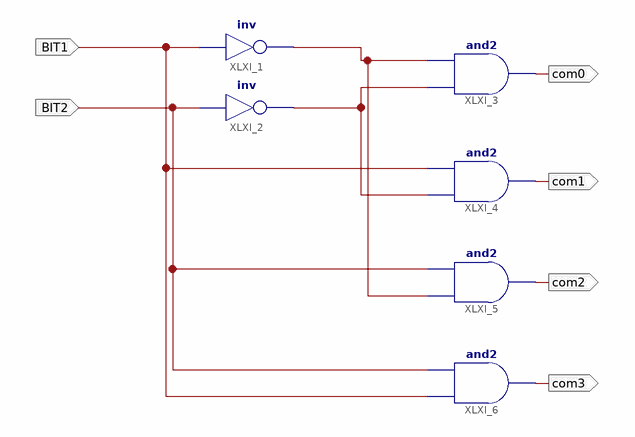
[diagram p0: schematic sheet 1]
// Xilinx ISE schematic Decode2_4.sch (spartan6) as structural Verilog: 6 symbols, 6 ports
module Decode2_4 (
  input  BIT1,
  input  BIT2,
  output com0,
  output com1,
  output com2,
  output com3
);

  wire XLXN_1, XLXN_2;

  not XLXI_1 (XLXN_1, BIT1);
  not XLXI_2 (XLXN_2, BIT2);
  and XLXI_3 (com0, XLXN_2, XLXN_1);
  and XLXI_4 (com1, XLXN_2, BIT1);
  and XLXI_5 (com2, XLXN_1, BIT2);
  and XLXI_6 (com3, BIT1, BIT2);
endmodule
